# EAGLE schematic Schematic (EAGLE 9.3.0)
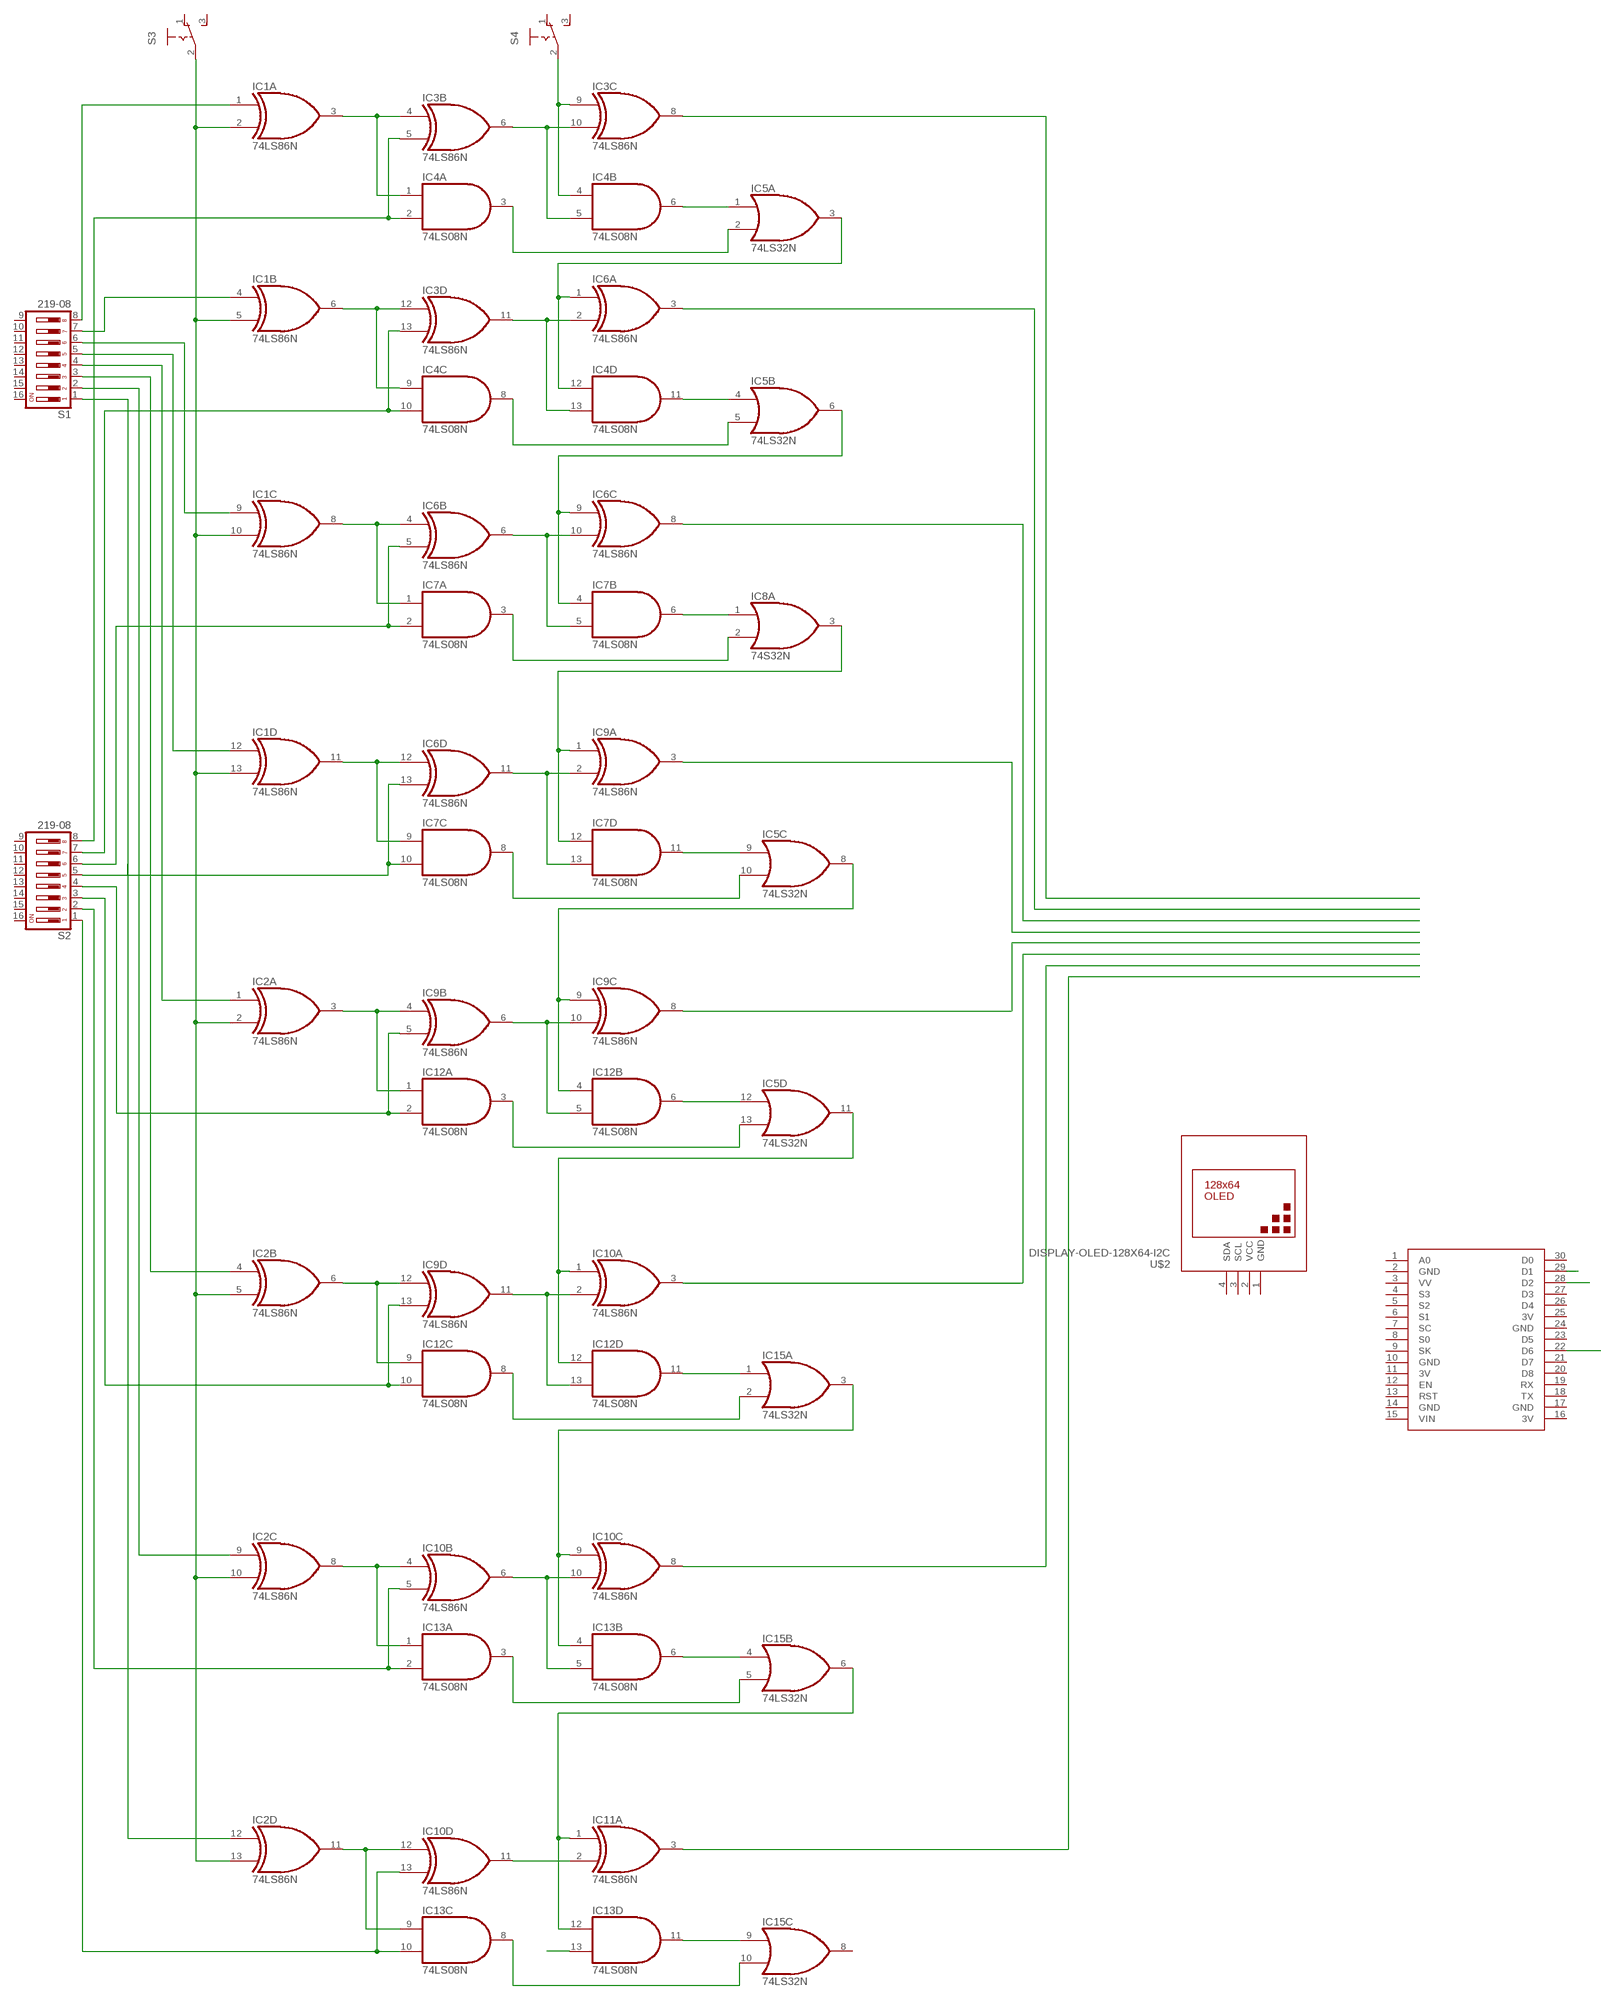
[diagram p0: schematic, sheet 1]

## Parts
IC1  74LS86N  [DIL14]
IC2  74LS86N  [DIL14]
IC3  74LS86N  [DIL14]
IC4  74LS08N  [DIL14]
IC5  74LS32N  [DIL14]
IC6  74LS86N  [DIL14]
IC7  74LS08N  [DIL14]
IC8  74S32N  [DIL14]
IC9  74LS86N  [DIL14]
IC10  74LS86N  [DIL14]
IC11  74LS86N  [DIL14]
IC12  74LS08N  [DIL14]
IC13  74LS08N  [DIL14]
IC15  74LS32N  [DIL14]
S1  219-08  [CTS-219-08]
S2  219-08  [CTS-219-08]
S3  M251  [M251]
S4  M251  [M251]
U$1  NODEMCU  [NODEMCU]
U$2  DISPLAY-OLED-128X64-I2C  [DISPLAY-OLED-128X64-I2C]

## Nets
N$1: IC1.1(A:I0) S1.8
N$2: IC1.3(A:O) IC3.4(B:I0) IC4.1(A:I0)
N$3: IC3.6(B:O) IC3.10(C:I1) IC4.5(B:I1)
N$4: IC3.5(B:I1) IC4.2(A:I1) S2.8
N$5: IC3.9(C:I0) IC4.4(B:I0) S4.2(P)
N$6: IC4.3(A:O) IC5.2(A:I1)
N$7: IC4.6(B:O) IC5.1(A:I0)
N$8: IC1.2(A:I1) IC1.5(B:I1) IC1.10(C:I1) IC1.13(D:I1) IC2.2(A:I1) IC2.5(B:I1) IC2.10(C:I1) IC2.13(D:I1) S3.2(P)
N$9: IC1.4(B:I0) S1.7
N$10: IC1.6(B:O) IC3.12(D:I0) IC4.9(C:I0)
N$11: IC3.13(D:I1) IC4.10(C:I1) S2.7
N$12: IC1.9(C:I0) S1.6
N$13: IC3.11(D:O) IC4.13(D:I1) IC6.2(A:I1)
N$14: IC4.12(D:I0) IC5.3(A:O) IC6.1(A:I0)
N$15: IC1.8(C:O) IC6.4(B:I0) IC7.1(A:I0)
N$16: IC4.8(C:O) IC5.5(B:I1)
N$17: IC4.11(D:O) IC5.4(B:I0)
N$18: IC9.3(A:O)
N$19: IC6.8(C:O)
N$20: IC6.5(B:I1) IC7.2(A:I1) S2.6
N$21: IC7.6(B:O) IC8.1(A:I0)
N$22: IC6.6(B:O) IC6.10(C:I1) IC7.5(B:I1)
N$23: IC7.3(A:O) IC8.2(A:I1)
N$24: IC5.6(B:O) IC6.9(C:I0) IC7.4(B:I0)
N$25: IC1.12(D:I0) S1.5
N$26: IC6.3(A:O)
N$27: IC1.11(D:O) IC6.12(D:I0) IC7.9(C:I0)
N$28: IC6.13(D:I1) IC7.10(C:I1) S2.5
N$29: IC6.11(D:O) IC7.13(D:I1) IC9.2(A:I1)
N$30: IC7.12(D:I0) IC8.3(A:O) IC9.1(A:I0)
N$31: IC5.9(C:I0) IC7.11(D:O)
N$32: IC5.10(C:I1) IC7.8(C:O)
N$33: IC3.8(C:O)
N$34: IC2.4(B:I0) S1.3
N$35: IC2.1(A:I0) S1.4
N$36: IC2.9(C:I0) S1.2
N$37: IC2.12(D:I0) S1.1
N$39: IC2.3(A:O) IC9.4(B:I0) IC12.1(A:I0)
N$40: IC9.6(B:O) IC9.10(C:I1) IC12.5(B:I1)
N$41: IC9.5(B:I1) IC12.2(A:I1) S2.4
N$43: IC5.8(C:O) IC9.9(C:I0) IC12.4(B:I0)
N$44: IC5.13(D:I1) IC12.3(A:O)
N$45: IC10.5(B:I1) IC13.2(A:I1) S2.2
N$47: IC5.12(D:I0) IC12.6(B:O)
N$48: IC9.13(D:I1) IC12.10(C:I1) S2.3
N$49: IC10.13(D:I1) IC13.10(C:I1) S2.1
N$50: IC2.6(B:O) IC9.12(D:I0) IC12.9(C:I0)
N$51: IC2.8(C:O) IC10.4(B:I0) IC13.1(A:I0)
N$52: IC2.11(D:O) IC10.12(D:I0) IC13.9(C:I0)
N$53: IC9.11(D:O) IC10.2(A:I1) IC12.13(D:I1)
N$54: IC5.11(D:O) IC10.1(A:I0) IC12.12(D:I0)
N$55: IC12.8(C:O) IC15.2(A:I1)
N$56: IC12.11(D:O) IC15.1(A:I0)
N$57: IC10.3(A:O)
N$58: IC13.6(B:O) IC15.4(B:I0)
N$59: IC10.6(B:O) IC10.10(C:I1) IC13.5(B:I1)
N$60: IC10.9(C:I0) IC13.4(B:I0) IC15.3(A:O)
N$61: IC13.3(A:O) IC15.5(B:I1)
N$62: IC11.1(A:I0) IC13.12(D:I0) IC15.6(B:O)
N$63: IC10.8(C:O)
N$64: IC10.11(D:O) IC11.2(A:I1)
N$65: IC13.13(D:I1)
N$66: IC13.11(D:O) IC15.9(C:I0)
N$67: IC11.3(A:O)
N$68: IC13.8(C:O) IC15.10(C:I1)
N$69: U$1.29(D1)
N$70: IC9.8(C:O)
N$71: U$1.22(D6)
N$72: U$1.28(D2)
Unconnected: IC3.1(A:I0) IC3.2(A:I1) IC3.3(A:O) IC8.4(B:I0) IC8.5(B:I1) IC8.6(B:O) IC8.8(C:O) IC8.9(C:I0) IC8.10(C:I1) IC8.11(D:O) IC8.12(D:I0) IC8.13(D:I1) IC11.4(B:I0) IC11.5(B:I1) IC11.6(B:O) IC11.8(C:O) IC11.9(C:I0) IC11.10(C:I1) IC11.11(D:O) IC11.12(D:I0) IC11.13(D:I1) IC15.8(C:O) IC15.11(D:O) IC15.12(D:I0) IC15.13(D:I1) S1.9 S1.10 S1.11 S1.12 S1.13 S1.14 S1.15 S1.16 S2.9 S2.10 S2.11 S2.12 S2.13 S2.14 S2.15 S2.16 S3.1(O) S3.3(S) S4.1(O) S4.3(S) U$1.1(A0) U$1.3(VV) U$1.4(S3) U$1.5(S2) U$1.6(S1) U$1.7(SC) U$1.8(S0) U$1.9(SK) U$1.12(EN) U$1.13(RST) U$1.15(VIN) U$1.18(TX) U$1.19(RX) U$1.20(D8) U$1.21(D7) U$1.23(D5) U$1.26(D4) U$1.27(D3) U$1.30(D0) U$2.3(SCL) U$2.4(SDA)

## Power pins joined to a net without a drawn wire
3V: U$1.11(3V) U$1.16(3V) U$1.25(3V)
GND: IC1.7(P:GND) IC2.7(P:GND) IC3.7(P:GND) IC4.7(P:GND) IC5.7(P:GND) IC6.7(P:GND) IC7.7(P:GND) IC8.7(P:GND) IC9.7(P:GND) IC10.7(P:GND) IC11.7(P:GND) IC12.7(P:GND) IC13.7(P:GND) IC15.7(P:GND) U$1.2(GND) U$1.10(GND) U$1.14(GND) U$1.17(GND) U$1.24(GND) U$2.1(GND)
VCC: IC1.14(P:VCC) IC2.14(P:VCC) IC3.14(P:VCC) IC4.14(P:VCC) IC5.14(P:VCC) IC6.14(P:VCC) IC7.14(P:VCC) IC8.14(P:VCC) IC9.14(P:VCC) IC10.14(P:VCC) IC11.14(P:VCC) IC12.14(P:VCC) IC13.14(P:VCC) IC15.14(P:VCC) U$2.2(VCC)

## Library data of the parts
IC1-IC3 IC6 IC9-IC11 = 74xx-us:74*86: Quad 2-input EXCLUSIV-OR (XOR) gate
IC4 IC7 IC12 IC13 = 74xx-us:74*08: Quad 2-input AND gate
IC5 IC8 IC15 = 74xx-us:74*32: Quad 2-input OR gate
S1 S2 = switch-dil:219-08*: Surface Mount DIP Switch Series 219 SMT CTS Electronic Components Sourc: www.ctscorp.com; OC_FARNELL: unknown; OC_NEWARK: unknown
S3 S4 = switch:M251: SLIDING SWITCH Mors, distributor Buerklin, 11G702
U$1 = nodemcu:NODEMCU
U$2 = diy-modules:DISPLAY-OLED-128X64-I2C: 128x64 Dot Matrix OLED Module based on SSD1306 chip Variant with I2C interface More details available here: http://www.instructables.com/id/Monochrome-096-i2c-OLED-display-with-arduino-SSD13/ SSD1306 datasheet: https://cdn-shop.adafruit.com/datasheets/SSD1306.pdf Click here to find device on ebay.com <http://www.ebay.com/sch/oled+display+128x64+iic> Note: There are two variants: I2C and SPI. Search for the proper version.